# EAGLE design mr_radar_frogpond (EAGLE 5.11)
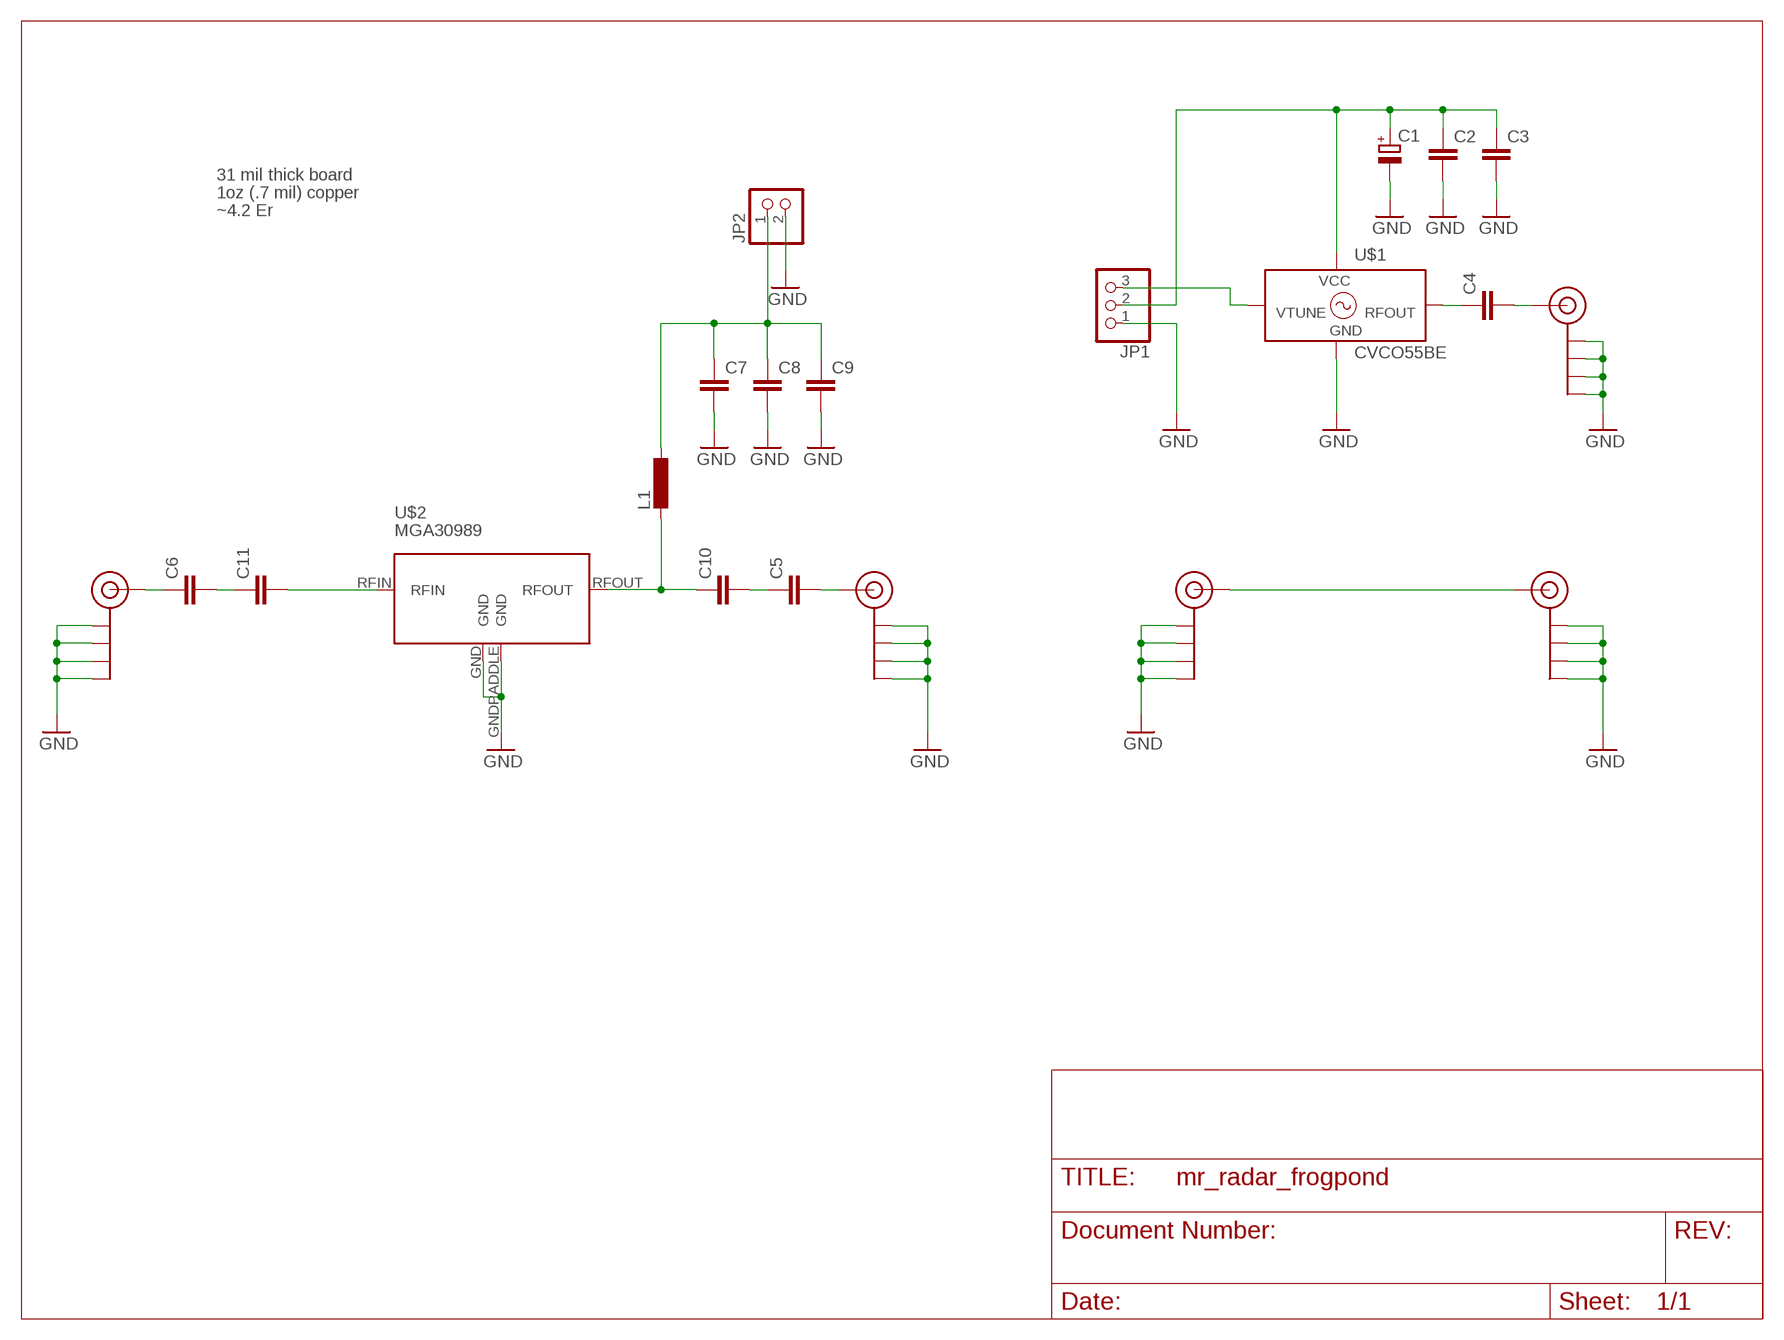
[diagram p0: schematic, sheet 1]

## Parts
C1  CAPACITOR-POLB  [3528/B]
C2  CAPACITOR-0603  [0603-CAP]
C3  CAPACITOR-0603  [0603-CAP]
C4  CAPACITOR-0603  [0603-CAP]
C5  CAPACITOR-0402  [0402-CAP]
C6  CAPACITOR-0402  [0402-CAP]
C7  CAPACITOR-0805  [0805-CAP]
C8  CAPACITOR-0402  [0402-CAP]
C9  CAPACITOR-0402  [0402-CAP]
C10  CAPACITOR-0402  [0402-CAP]
C11  CAPACITOR-0402  [0402-CAP]
J$1  SMA_EDGE  [SMA-EDGE]
J$2  SMA_EDGE  [SMA-EDGE]
J$3  SMA_EDGE  [SMA-EDGE]
J$4  SMA_EDGE  [SMA-EDGE]
J$5  SMA_EDGE  [SMA-EDGE]
JP1  PINHD-1X3  [1X03]
JP2  PINHD-1X2  [1X02]
L1  INDUCTOR-0603  [0603-IND]
U$1  CVCO55BE  [CVCO55BE]
U$2  MGA30989  [SOT89]

## Nets
GND: C1.- C2.P$2 C3.P$2 C7.P$2 C8.P$2 C9.P$2 J$1.GND@0(GND) J$1.GND@1(GND) J$1.GND@2(GND) J$1.GND@3(GND) J$2.GND@0(GND) J$2.GND@1(GND) J$2.GND@2(GND) J$2.GND@3(GND) J$3.GND@0(GND) J$3.GND@1(GND) J$3.GND@2(GND) J$3.GND@3(GND) J$4.GND@0(GND) J$4.GND@1(GND) J$4.GND@2(GND) J$4.GND@3(GND) J$5.GND@0(GND) J$5.GND@1(GND) J$5.GND@2(GND) J$5.GND@3(GND) JP1.1 JP2.2 U$1.P$1(GND) U$2.GND U$2.GNDPADDLE(GND)
N$1: JP1.3 U$1.P$VT(VTUNE)
N$2: C4.P$1 U$1.P$RFOUT(RFOUT)
N$3: C4.P$2 J$1.SIG(SIGNAL)
N$4: J$2.SIG(SIGNAL) J$3.SIG(SIGNAL)
N$5: C1.+ C2.P$1 C3.P$1 JP1.2 U$1.P$VCC(VCC)
N$6: C5.P$1 C10.P$2
N$8: C6.P$1 J$5.SIG(SIGNAL)
N$9: C5.P$2 J$4.SIG(SIGNAL)
N$10: C7.P$1 C8.P$1 C9.P$1 JP2.1 L1.P$1
N$11: C6.P$2 C11.P$1
N$12: C11.P$2 U$2.RFIN
N$13: C10.P$1 L1.P$2 U$2.RFOUT

## Notes on the sheet
- 31 mil thick board
- 1oz (.7 mil) copper
- ~4.2 Er

## Power pins joined to a net without a drawn wire
GND: U$1.P$3(GND) U$1.P$4(GND) U$1.P$5(GND) U$1.P$6(GND) U$1.P$8(GND) U$1.P$9(GND) U$1.P$10(GND) U$1.P$11(GND) U$1.P$12(GND) U$1.P$13(GND) U$1.P$15(GND) U$1.P$16(GND)

## Library data of the parts
C1 = pel_dipol_comp:CAPACITOR-POL
C2-C11 = pel_dipol_comp:CAPACITOR
J$1-J$5 = SparkFun:SMA_EDGE: SMA Antenna Connector End launch SMA connector. The paste layer has been removed so that the connector can be hand soldered onto the board after reflow.
JP1 = pinhead:PINHD-1X3: PIN HEADER
JP2 = pinhead:PINHD-1X2: PIN HEADER
L1 = pel_dipol_comp:INDUCTOR
U$1 = mr_radar:CVCO55BE
U$2 = mr_radar:MGA30989

## Board
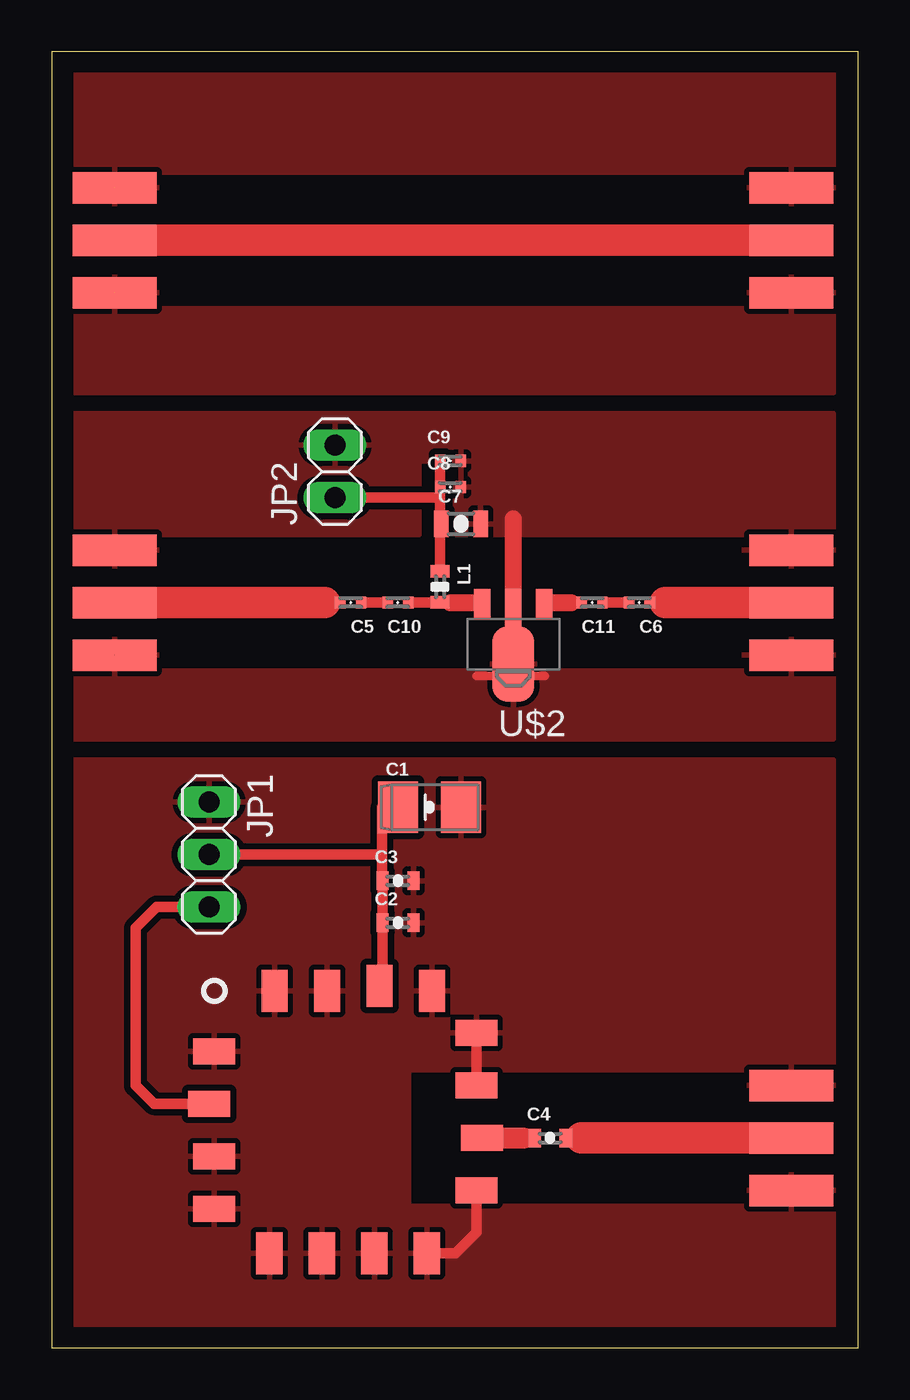
[diagram p1: board, top side]
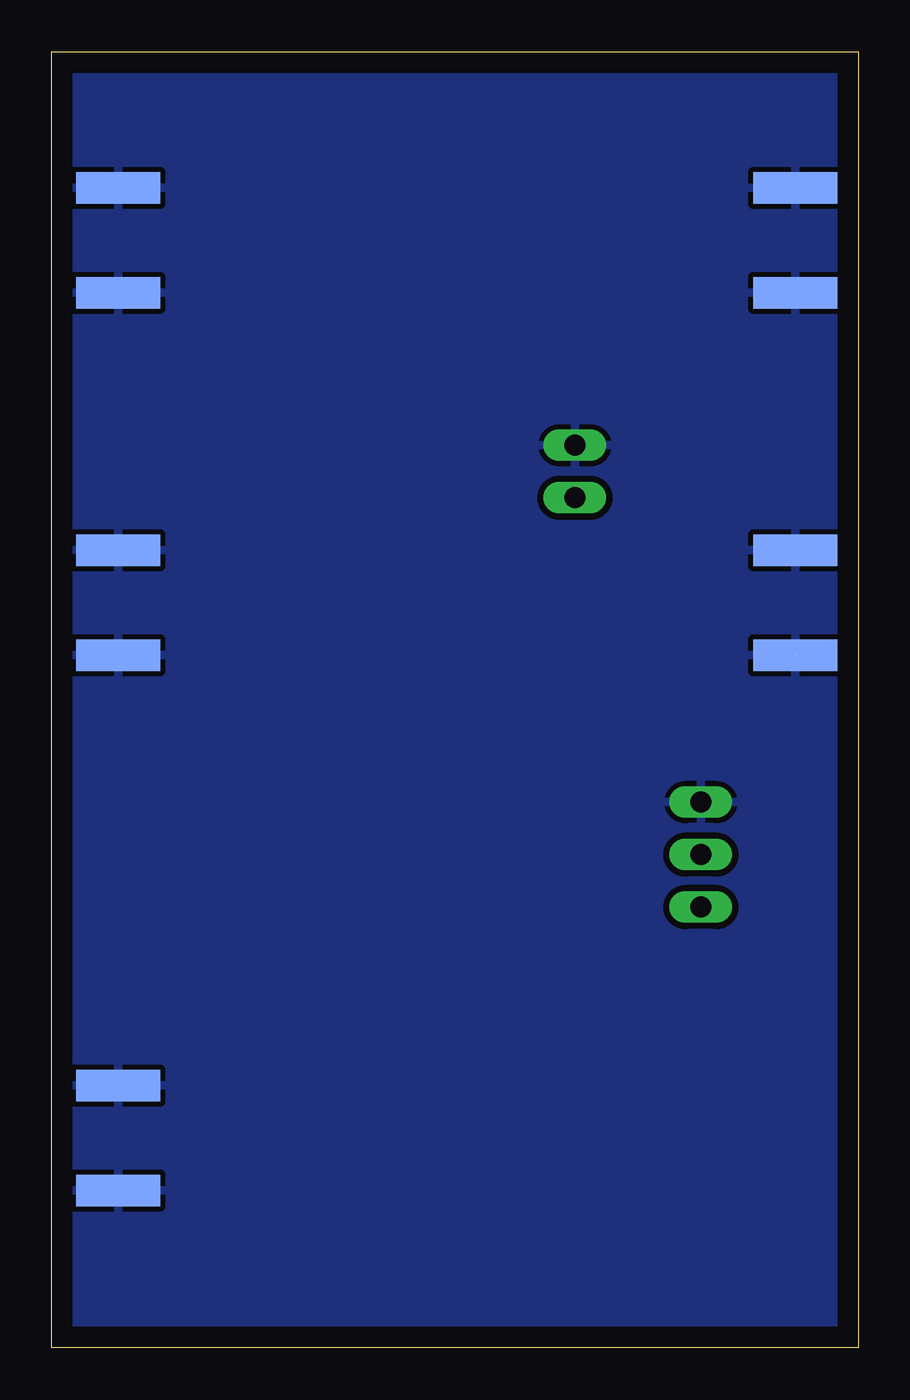
[diagram p2: board, bottom side, seen from below]

Size 39.04 x 62.73 mm. Coordinates in mm from the lower left corner, seen from the top.
Outline: 0,0 39.04,0 39.04,62.73 0,62.73 0,0
Copper layers (1*16): Top 0.035mm / dielectric 1.5mm / Bottom 0.035mm
Design rules "default *": minimum track width 10mil, minimum drill 24mil, track to track 12mil, track to pad 12mil, pad to pad 12mil, via to via 12mil, smd to smd 12mil, copper to edge 40mil, drill to drill 12mil, minimum pad ring 10mil, minimum via ring 8mil, stop-mask expansion 4mil, vias tented up to drill 0mil, thermal gap 10mil

### Footprints (pad centres in the part's own frame; a part is rotated, then mirrored left to right if it is on the bottom)
3528/B = smd 1.95 x 2.5: + -1.525,0; - 1.525,0
0603-CAP = smd 0.6 x 0.9: P$1 -0.75,0; P$2 0.75,0
0402-CAP = smd 0.5 x 0.6: P$1 -0.5,0; P$2 0.5,0
0805-CAP = smd 0.7 x 1.3: P$1 -0.95,0; P$2 0.95,0
SMA-EDGE = smd 1.524 x 4.064: GND@0 0,0; GND@1 5.08,0; SIG 2.54,0 | smd 1.524 x 4.064 bottom: GND@2 0,0; GND@3 5.08,0
1X03 = drill 1.016 long: 1 -2.54,0; 2 0,0; 3 2.54,0
1X02 = drill 1.016 long: 1 -1.27,0; 2 1.27,0
0603-IND = smd 0.6 x 0.9: P$1 -0.75,0; P$2 0.75,0
CVCO55BE = smd 1.27 x 2.032: P$1 -3.429,-6.35; P$3 1.651,-6.35; P$4 4.191,-6.35; P$9 -1.778,6.35; P$15 -4.318,6.35; P$16 3.302,6.35; P$RFOUT 0.762,6.604; P$VT -0.889,-6.604 | smd 2.032 x 1.27: P$5 -6.35,-3.429; P$6 -6.35,-0.889; P$8 -6.35,4.191; P$10 6.35,-3.683; P$11 6.35,-1.143; P$12 6.35,1.397; P$13 6.35,3.937; P$VCC -6.604,1.651
SOT89 = smd 0.8 x 1.9: GND 0,-1.727 | smd 2.032 x 3.65: GNDPADDLE 0,0.94 | smd 0.8 x 1.4: RFIN -1.499,-1.981; RFOUT 1.499,-1.981

### Placement (x,y rotation side)
C1  18.29,26.16 0 top
C2  16.76,20.57 0 top
C3  16.76,22.61 0 top
C4  24.13,10.16 0 top
C5  14.48,36.07 180 top
C6  28.45,36.07 180 top
C7  19.81,39.88 0 top
C8  19.3,41.66 0 top
C9  19.3,42.93 0 top
C10  16.76,36.07 180 top
C11  26.16,36.07 180 top
J$1  35.81,12.7 270 top
J$2  35.81,51.05 90 top
J$3  3.05,51.05 90 top
J$4  3.05,33.53 90 top
J$5  35.81,38.61 270 top
JP1  7.62,23.88 270 top
JP2  13.72,42.42 90 top
L1  18.8,36.83 270 top
U$1  14.22,10.92 270 top
U$2  22.35,34.04 180 top

### Tracks (layer width: path | path; a pad name or v marks a point on that pad's centre or on a via)
GND  (3 unrouted)
  Top 0.254: J$3.GND@3 1.27,56.13 1.27,55.63
  Top 0.406: 21.59,32.51 20.57,32.51 | 22.86,32.51 23.88,32.51
  Top 0.508: U$1.P$9 U$1.P$15 | U$1.P$16 20.57,5.59 19.56,4.57 U$1.P$13
  Top 0.813: U$2.GND 22.35,40.13
  pour Top: 37.85,28.45 37.85,12.19 33.78,11.94 33.78,13.46 17.27,13.46 17.27,6.86 33.78,6.86 33.78,8.38 37.85,8.38 37.85,0.76 1.02,1.02 1.02,28.45
  pour Top: 1.02,29.46 1.02,34.29 5.05,34.29 arc-90 5.08,34.26 5.08,32.77 21.31,32.77 arc90 21.34,32.79 21.34,34.29 21.84,34.8 22.86,34.8 23.37,34.29 23.37,32.77 33.53,32.77 33.53,34.29 37.85,34.29 37.85,29.46
  pour Top: 1.02,45.21 1.02,37.85 5.08,37.85 5.08,39.37 17.78,39.37 17.78,42.93 19.56,42.93 19.56,39.37 33.53,39.37 33.53,37.85 37.85,37.85 37.85,45.21
  pour Top: 1.02,46.23 1.02,51.82 5.08,51.82 5.08,50.29 33.78,50.29 33.78,51.82 37.85,51.82 37.85,46.23
  pour Top: 1.27,55.37 5.08,55.37 5.08,56.9 14.48,56.9 23.88,56.9 33.78,56.9 33.78,55.37 37.85,55.37 37.85,62.48 30.99,62.48 26.67,62.48 1.02,62.48 1.02,55.37
  pour Bottom: -1.27,64.52 -1.27,-3.3 41.15,-3.3 41.15,67.06 -1.02,67.06 -1.02,67.56
N$1
  Top 0.508: U$1.P$VT 4.95,11.81 4.06,12.7 4.06,20.32 5.08,21.34 JP1.3
N$2
  Top 0.254: 22.86,10.16 C4.P$1
  Top 1.016: U$1.P$RFOUT 22.86,10.16
N$3
  Top 0.254: C4.P$2 25.91,10.16
  Top 1.524: 25.65,10.16 25.91,10.16 J$1.SIG
N$4
  Top 1.524: J$3.SIG J$2.SIG
N$5
  Top 0.508: JP1.2 16,23.88 | 16,23.88 16,22.62 C3.P$1 C2.P$1 16.01,17.66 U$1.P$VCC | C1.+ 16.26,26.42 16,26.16 16,23.88
N$6
  Top 0.508: C5.P$1 C10.P$2
N$8
  Top 0.508: C6.P$1 29.72,36.07
  Top 1.524: 29.72,36.07 J$5.SIG
N$9
  Top 0.508: 13.21,36.07 C5.P$2
  Top 1.524: J$4.SIG 13.21,36.07
N$10
  Top 0.508: L1.P$1 18.8,39.78 arc-45 18.82,39.83 C7.P$1 18.83,39.91 arc-45 18.8,39.97 18.8,41.15 | 18.8,41.15 C8.P$1 C9.P$1 | JP2.1 18.8,41.15
N$11
  Top 0.508: C11.P$1 C6.P$2
N$12
  Top 0.254: 25.15,36.07 C11.P$2
  Top 0.813: U$2.RFIN 23.88,36.05 arc-45 23.93,36.07 25.15,36.07
N$13
  Top 0.254: L1.P$2 L1.P$2 arc45 18.82,36.07 19.3,36.07
  Top 0.508: C10.P$1 18.77,36.07 arc45 L1.P$2 | 20.76,36.08 arc-45 20.81,36.06 U$2.RFOUT
  Top 0.813: 20.76,36.08 arc-45 20.73,36.07 19.3,36.07